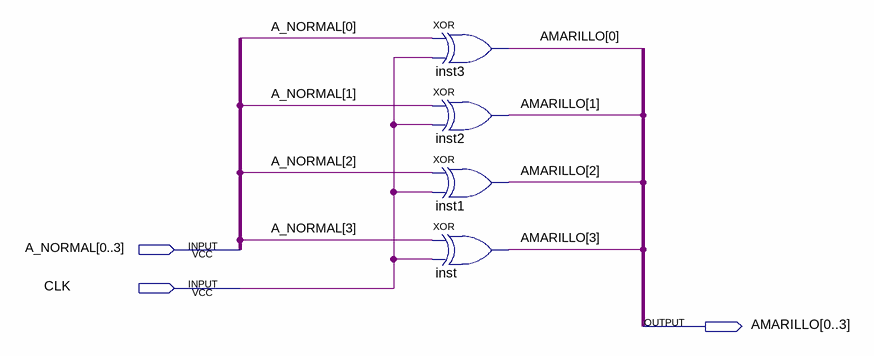
[diagram p0: schematic sheet]
// Quartus schematic MaquinaDeParpadeo.bdf as structural Verilog: 4 symbols, 3 pins
module MaquinaDeParpadeo (
  input  [0:3] A_NORMAL,
  input  CLK,
  output [0:3] AMARILLO
);

  xor inst3 (AMARILLO[0], A_NORMAL[0], CLK);
  xor inst2 (AMARILLO[1], A_NORMAL[1], CLK);
  xor inst1 (AMARILLO[2], A_NORMAL[2], CLK);
  xor inst (AMARILLO[3], A_NORMAL[3], CLK);
endmodule
